# Altium schematic sheet Schematic.SchDoc
size A; SheetNumber: 1; SheetTotal: 1
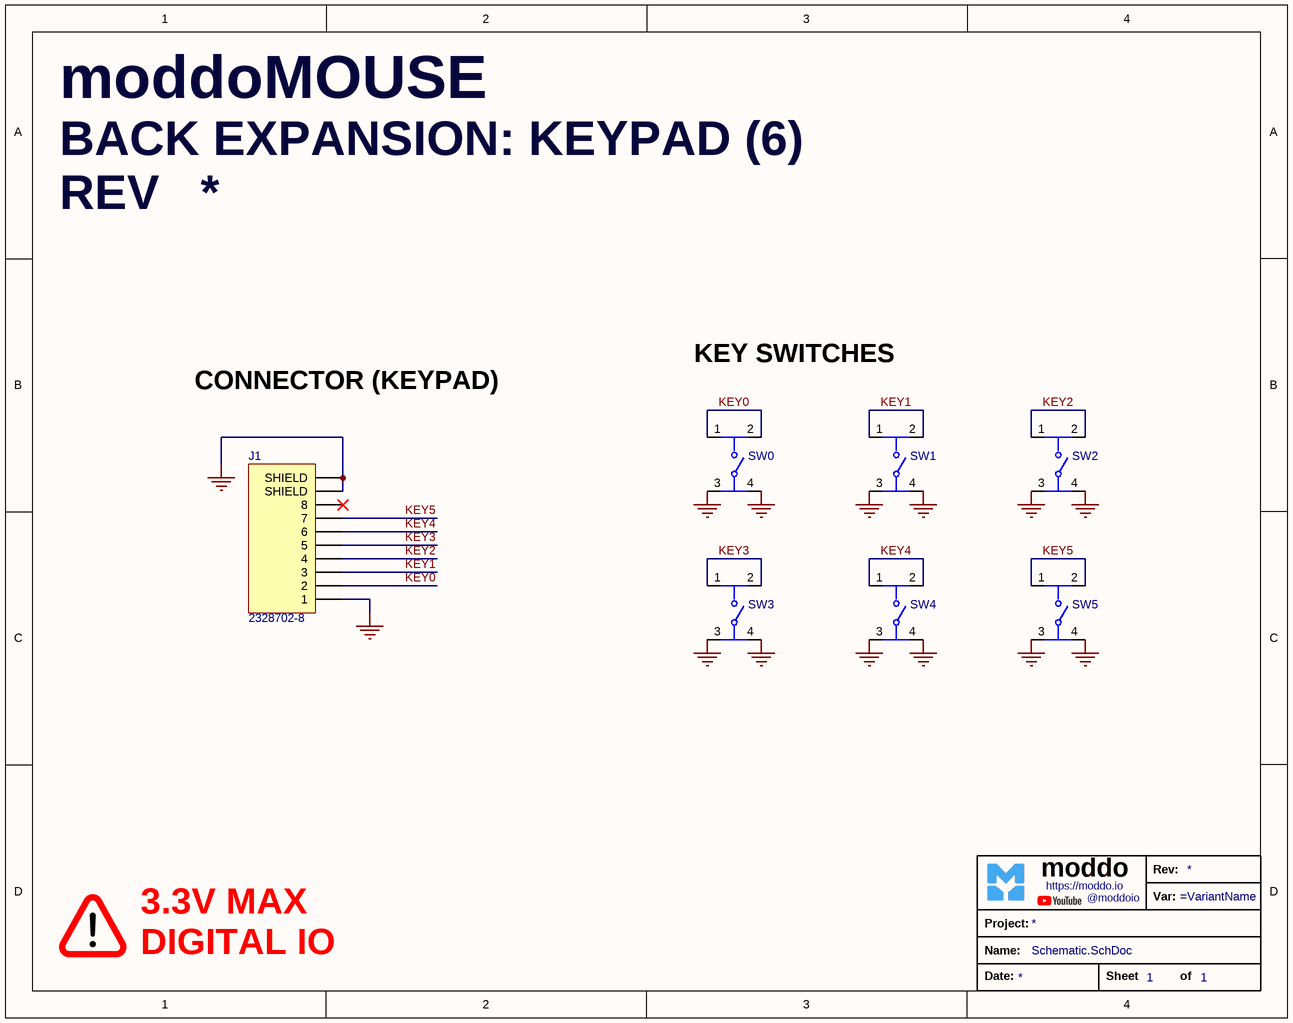
[diagram p0: Schematic.SchDoc]

## Parts
?  TitleBlock_moddo  (value not drawn)  (graphical)
J1  2328702-8  [2328702-8]
SW0  GT-TS090C-H031-L5  [Switch_6_2mm_6_2mm_3_1mm]  (value not drawn)
SW1  GT-TS090C-H031-L5  [Switch_6_2mm_6_2mm_3_1mm]  (value not drawn)
SW2  GT-TS090C-H031-L5  [Switch_6_2mm_6_2mm_3_1mm]  (value not drawn)
SW3  GT-TS090C-H031-L5  [Switch_6_2mm_6_2mm_3_1mm]  (value not drawn)
SW4  GT-TS090C-H031-L5  [Switch_6_2mm_6_2mm_3_1mm]  (value not drawn)
SW5  GT-TS090C-H031-L5  [Switch_6_2mm_6_2mm_3_1mm]  (value not drawn)

## Nets
GND: J1.1 J1.S1(SHIELD) J1.S2(SHIELD) SW0.3 SW0.4 SW1.3 SW1.4 SW2.3 SW2.4 SW3.3 SW3.4 SW4.3 SW4.4 SW5.3 SW5.4
KEY0: J1.2 SW0.1 SW0.2
KEY1: J1.3 SW1.1 SW1.2
KEY2: J1.4 SW2.1 SW2.2
KEY3: J1.5 SW3.1 SW3.2
KEY4: J1.6 SW4.1 SW4.2
KEY5: J1.7 SW5.1 SW5.2

Not connected (* = marked no-connect by the designer): J1 8*

## Notes on the sheet
- moddoMOUSE <https://moddo.io/>
- BACK EXPANSION: KEYPAD (6) <https://moddo.io/>
- REV
- KEY SWITCHES
- CONNECTOR (KEYPAD)
- 3.3V MAX
- DIGITAL IO
- (in symbol TitleBlock_moddo) Rev:; moddo; https://moddo.io; Var:; @moddoio; Project:; Name:; Date:; Sheet; of

## Library data of the parts
J1 = 2328702-8: FFC/FPC Connector, 8 Contact(s), 1 Row(s), Right Angle, Solder Terminal, Natural Insulator; Manufacturer: TE Connectivity; Actuator Material: Thermoplastic; Actuator Color: Black; Plating: Gold; Number of Positions: 8; Voltage Rating: 50V; Connector System: Wire-to-Board; Gender: Receptacle; Sealable: No (Without); Supplier 1: Arrow Electronics; Manufacturer Part Number: 2328702-8; RoHS: Yes; Category: FFC / FPC; Stock 1: 56000; Pricing 1: 28000=0.0961 (USD); Mounting Technology: Surface Mount; Contact Material: Copper Alloy; Contact Plating: Gold; Housing Material: Thermoplastic; Housing Color: Natural; Min Operating Temperature: -40°C; Max Operating Temperature: 85°C; Packaging: Cut Tape; Termination: Solder; Series: -; Number of Contacts: 8; Number of Rows: 1; Operating Supply Voltage: 50V; Orientation: Right Angle; Length: 6mm; Height: 1mm; Flammability Rating: UL94 V-0; ComponentLink1URL: https://www.te.com/commerce/DocumentDelivery/DDEController?Action=srchrtrv&amp;DocNm=2328702&amp;DocType=Customer+Drawing&amp;DocLang=English&src-supplier=Digikey; ComponentLink1Description: https://www.te.com/commerce/DocumentDelivery/DDEController?Action=srchrtrv&amp;DocNm=2328702&amp;DocType=Customer+Drawing&amp;DocLang=English&src-supplier=Digikey; Supplier Part Number 1: 2328702-8
SW0-SW5 = GT-TS090C-H031-L5: Tactile Switch SPST 100gf 3.1mm SMD (SMT) Tab 6.2mm x 6.2mm Surface Mount; Manufacturer: G-Switch; Manufacturer Part Number: GT-TS090C-H031-L5